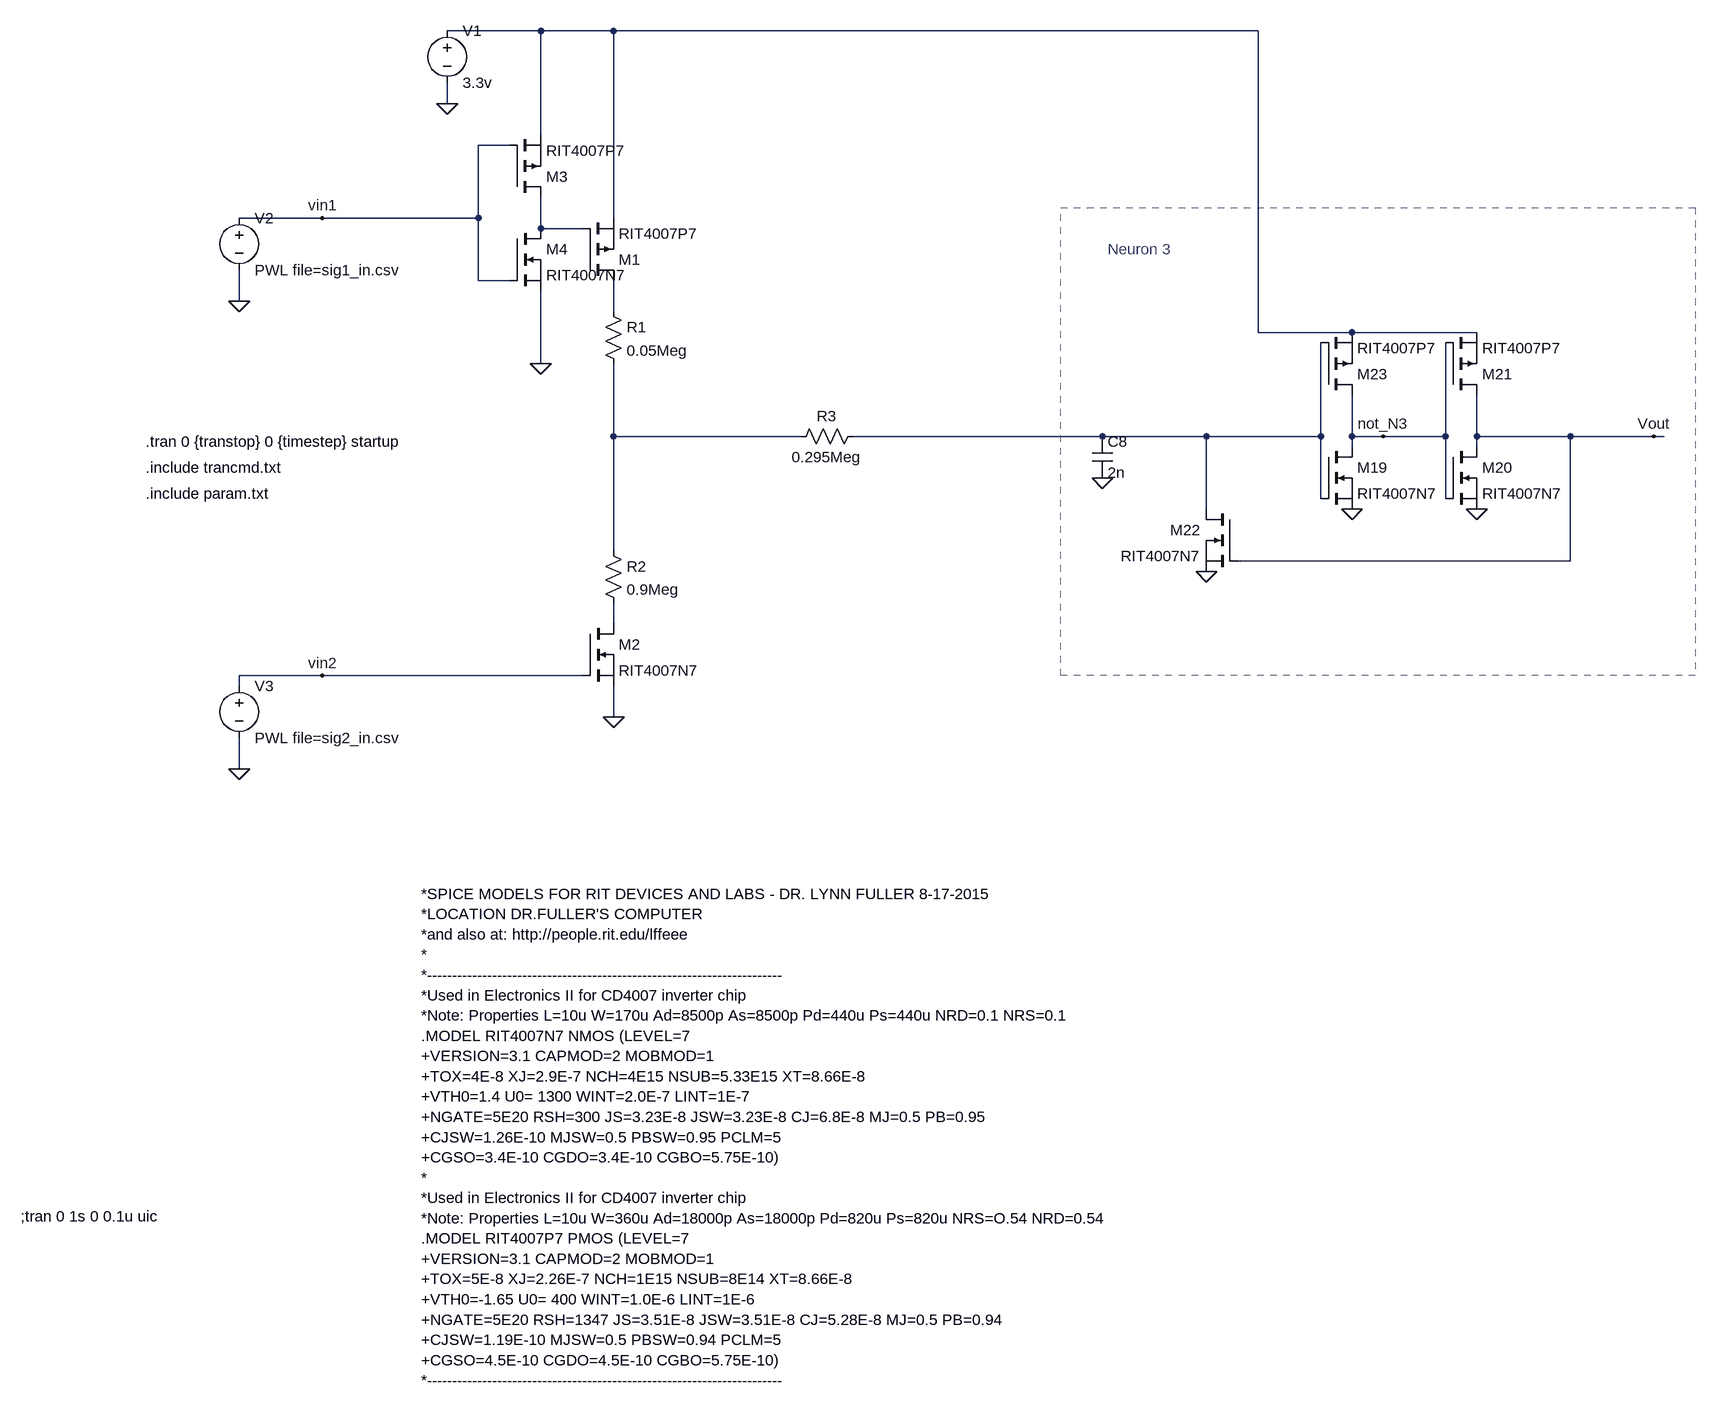
[diagram p0: schematic synapse_v6.asc]
synapse_v6.asc, the LTspice schematic file:
Version 4
SHEET 1 2660 1072
WIRE 240 -944 96 -944
WIRE 352 -944 240 -944
WIRE 1344 -944 352 -944
WIRE 96 -832 96 -864
WIRE 240 -784 240 -944
WIRE 192 -768 144 -768
WIRE -96 -656 -224 -656
WIRE 144 -656 144 -768
WIRE 144 -656 -96 -656
WIRE 352 -656 352 -944
WIRE 240 -640 240 -688
WIRE 304 -640 240 -640
WIRE 144 -560 144 -656
WIRE 192 -560 144 -560
WIRE -224 -528 -224 -576
WIRE 352 -512 352 -560
WIRE 1344 -480 1344 -944
WIRE 1488 -480 1344 -480
WIRE 1680 -480 1488 -480
WIRE 240 -432 240 -544
WIRE 352 -320 352 -432
WIRE 640 -320 352 -320
WIRE 1104 -320 720 -320
WIRE 1264 -320 1104 -320
WIRE 1440 -320 1440 -464
WIRE 1440 -320 1264 -320
WIRE 1488 -320 1488 -384
WIRE 1536 -320 1488 -320
WIRE 1632 -320 1632 -464
WIRE 1632 -320 1536 -320
WIRE 1680 -320 1680 -384
WIRE 1824 -320 1680 -320
WIRE 1952 -320 1824 -320
WIRE 1968 -320 1952 -320
WIRE 1488 -304 1488 -320
WIRE 1680 -304 1680 -320
WIRE 1440 -224 1440 -320
WIRE 1632 -224 1632 -320
WIRE 1264 -208 1264 -320
WIRE 352 -144 352 -320
WIRE 1824 -128 1824 -320
WIRE 1824 -128 1312 -128
WIRE 352 -32 352 -64
WIRE -96 48 -224 48
WIRE 304 48 -96 48
WIRE -224 64 -224 48
WIRE 352 112 352 64
WIRE -224 192 -224 144
FLAG 1264 -112 0
FLAG 1488 -208 0
FLAG 1680 -208 0
FLAG 1104 -256 0
FLAG 1536 -320 not_N3
FLAG 352 112 0
FLAG 240 -432 0
FLAG -224 192 0
FLAG -96 48 vin2
FLAG -224 -528 0
FLAG -96 -656 vin1
FLAG 96 -832 0
FLAG 1952 -320 Vout
SYMBOL nmos 1440 -304 R0
SYMATTR InstName M19
SYMATTR Value RIT4007N7
SYMBOL nmos 1632 -304 R0
SYMATTR InstName M20
SYMATTR Value RIT4007N7
SYMBOL pmos 1632 -384 M180
SYMATTR InstName M21
SYMATTR Value RIT4007P7
SYMBOL nmos 1312 -208 M0
SYMATTR InstName M22
SYMATTR Value RIT4007N7
SYMBOL pmos 1440 -384 M180
SYMATTR InstName M23
SYMATTR Value RIT4007P7
SYMBOL cap 1088 -320 R0
SYMATTR InstName C8
SYMATTR Value 2n
SYMBOL pmos 304 -560 M180
SYMATTR InstName M1
SYMATTR Value RIT4007P7
SYMBOL res 336 -528 R0
SYMATTR InstName R1
SYMATTR Value 0.05Meg
SYMBOL res 336 -160 R0
SYMATTR InstName R2
SYMATTR Value 0.9Meg
SYMBOL nmos 304 -32 R0
SYMATTR InstName M2
SYMATTR Value RIT4007N7
SYMBOL voltage 96 -960 R0
WINDOW 123 0 0 Left 0
WINDOW 39 0 0 Left 0
SYMATTR InstName V1
SYMATTR Value 3.3v
SYMBOL pmos 192 -688 M180
SYMATTR InstName M3
SYMATTR Value RIT4007P7
SYMBOL nmos 192 -640 R0
SYMATTR InstName M4
SYMATTR Value RIT4007N7
SYMBOL voltage -224 -672 R0
WINDOW 39 0 0 Left 0
WINDOW 123 0 0 Left 0
SYMATTR InstName V2
SYMATTR Value PWL file=sig1_in.csv
SYMBOL voltage -224 48 R0
WINDOW 39 0 0 Left 0
WINDOW 123 0 0 Left 0
SYMATTR InstName V3
SYMATTR Value PWL file=sig2_in.csv
SYMBOL res 736 -336 R90
WINDOW 0 0 56 VBottom 2
WINDOW 3 32 56 VTop 2
SYMATTR InstName R3
SYMATTR Value 0.295Meg
TEXT 56 384 Left 2 !*SPICE MODELS FOR RIT DEVICES AND LABS - DR. LYNN FULLER 8-17-2015\n*LOCATION DR.FULLER'S COMPUTER\n*and also at: http://people.rit.edu/lffeee\n*\n*-----------------------------------------------------------------------\n*Used in Electronics II for CD4007 inverter chip\n*Note: Properties L=10u W=170u Ad=8500p As=8500p Pd=440u Ps=440u NRD=0.1 NRS=0.1\n.MODEL RIT4007N7 NMOS (LEVEL=7\n+VERSION=3.1 CAPMOD=2 MOBMOD=1\n+TOX=4E-8 XJ=2.9E-7 NCH=4E15 NSUB=5.33E15 XT=8.66E-8\n+VTH0=1.4 U0= 1300 WINT=2.0E-7 LINT=1E-7\n+NGATE=5E20 RSH=300 JS=3.23E-8 JSW=3.23E-8 CJ=6.8E-8 MJ=0.5 PB=0.95\n+CJSW=1.26E-10 MJSW=0.5 PBSW=0.95 PCLM=5\n+CGSO=3.4E-10 CGDO=3.4E-10 CGBO=5.75E-10)\n*\n*Used in Electronics II for CD4007 inverter chip\n*Note: Properties L=10u W=360u Ad=18000p As=18000p Pd=820u Ps=820u NRS=O.54 NRD=0.54\n.MODEL RIT4007P7 PMOS (LEVEL=7\n+VERSION=3.1 CAPMOD=2 MOBMOD=1\n+TOX=5E-8 XJ=2.26E-7 NCH=1E15 NSUB=8E14 XT=8.66E-8\n+VTH0=-1.65 U0= 400 WINT=1.0E-6 LINT=1E-6\n+NGATE=5E20 RSH=1347 JS=3.51E-8 JSW=3.51E-8 CJ=5.28E-8 MJ=0.5 PB=0.94\n+CJSW=1.19E-10 MJSW=0.5 PBSW=0.94 PCLM=5\n+CGSO=4.5E-10 CGDO=4.5E-10 CGBO=5.75E-10)\n*-----------------------------------------------------------------------
TEXT -560 880 Left 2 !;tran 0 1s 0 0.1u uic
TEXT 1112 -608 Left 2 ;Neuron 3
TEXT -368 -312 Left 2 !.tran 0 {transtop} 0 {timestep} startup
TEXT -368 -272 Left 2 !.include trancmd.txt
TEXT -368 -232 Left 2 !.include param.txt
RECTANGLE Normal 2016 48 1040 -672 2

The netlist it stands for:
* synapse_v6.asc
M19 not_N3 N005 0 0 RIT4007N7
M20 Vout not_N3 0 0 RIT4007N7
M21 Vout not_N3 N001 N001 RIT4007P7
M22 N005 Vout 0 0 RIT4007N7
M23 not_N3 N005 N001 N001 RIT4007P7
C8 N005 0 2n
M1 N003 N002 N001 N001 RIT4007P7
R1 N003 N004 0.05Meg
R2 N004 N006 0.9Meg
M2 N006 vin2 0 0 RIT4007N7
V1 N001 0 3.3v
M3 N002 vin1 N001 N001 RIT4007P7
M4 N002 vin1 0 0 RIT4007N7
V2 vin1 0 PWL file=sig1_in.csv
V3 vin2 0 PWL file=sig2_in.csv
R3 N005 N004 0.295Meg
.model NMOS NMOS
.model PMOS PMOS
.lib standard.mos
*SPICE MODELS FOR RIT DEVICES AND LABS - DR. LYNN FULLER 8-17-2015
*LOCATION DR.FULLER'S COMPUTER
*and also at: http://people.rit.edu/lffeee
*
*-----------------------------------------------------------------------
*Used in Electronics II for CD4007 inverter chip
*Note: Properties L=10u W=170u Ad=8500p As=8500p Pd=440u Ps=440u NRD=0.1 NRS=0.1
.MODEL RIT4007N7 NMOS (LEVEL=7
+VERSION=3.1 CAPMOD=2 MOBMOD=1
+TOX=4E-8 XJ=2.9E-7 NCH=4E15 NSUB=5.33E15 XT=8.66E-8
+VTH0=1.4 U0= 1300 WINT=2.0E-7 LINT=1E-7
+NGATE=5E20 RSH=300 JS=3.23E-8 JSW=3.23E-8 CJ=6.8E-8 MJ=0.5 PB=0.95
+CJSW=1.26E-10 MJSW=0.5 PBSW=0.95 PCLM=5
+CGSO=3.4E-10 CGDO=3.4E-10 CGBO=5.75E-10)
*
*Used in Electronics II for CD4007 inverter chip
*Note: Properties L=10u W=360u Ad=18000p As=18000p Pd=820u Ps=820u NRS=O.54 NRD=0.54
.MODEL RIT4007P7 PMOS (LEVEL=7
+VERSION=3.1 CAPMOD=2 MOBMOD=1
+TOX=5E-8 XJ=2.26E-7 NCH=1E15 NSUB=8E14 XT=8.66E-8
+VTH0=-1.65 U0= 400 WINT=1.0E-6 LINT=1E-6
+NGATE=5E20 RSH=1347 JS=3.51E-8 JSW=3.51E-8 CJ=5.28E-8 MJ=0.5 PB=0.94
+CJSW=1.19E-10 MJSW=0.5 PBSW=0.94 PCLM=5
+CGSO=4.5E-10 CGDO=4.5E-10 CGBO=5.75E-10)
*-----------------------------------------------------------------------
;tran 0 1s 0 0.1u uic
* Neuron 3
.tran 0 {transtop} 0 {timestep} startup
.include trancmd.txt
.include param.txt
.backanno
.end